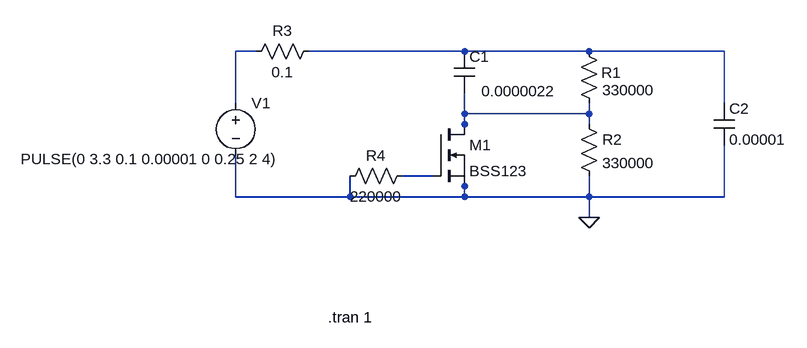
[diagram p0: schematic power-autostart.asc]
power-autostart.asc, the LTspice schematic file:
Version 4
SHEET 1 880 680
WIRE -176 96 -208 96
WIRE 144 96 -96 96
WIRE 336 96 144 96
WIRE 544 96 336 96
WIRE -208 176 -208 96
WIRE 544 176 544 96
WIRE 144 192 144 160
WIRE 336 192 336 176
WIRE 336 192 144 192
WIRE 144 208 144 192
WIRE 336 208 336 192
WIRE 144 224 144 208
WIRE 96 288 48 288
WIRE 144 304 144 288
WIRE -208 320 -208 256
WIRE -32 320 -32 288
WIRE -32 320 -208 320
WIRE 144 320 144 304
WIRE 144 320 -32 320
WIRE 336 320 336 288
WIRE 336 320 144 320
WIRE 544 320 544 240
WIRE 544 320 336 320
WIRE 336 352 336 320
FLAG 336 352 0
SYMBOL res 320 80 R0
WINDOW 0 35 49 Left 0
SYMATTR InstName R1
SYMATTR Value 330000
SYMBOL res 320 192 R0
SYMATTR InstName R2
SYMATTR Value 330000
SYMBOL cap 128 96 R0
WINDOW 3 42 61 Left 0
SYMATTR InstName C1
SYMATTR Value 0.0000022
SYMBOL voltage -208 160 R0
WINDOW 3 -331 102 Left 0
WINDOW 123 0 0 Left 0
WINDOW 39 0 0 Left 0
SYMATTR InstName V1
SYMATTR Value PULSE(0 3.3 0.1 0.00001 0 0.25 2 4)
SYMBOL cap 528 176 R0
SYMATTR InstName C2
SYMATTR Value 0.00001
SYMBOL res -80 80 R90
WINDOW 0 0 56 VBottom 0
WINDOW 3 32 56 VTop 0
SYMATTR InstName R3
SYMATTR Value 0.1
SYMBOL nmos 96 208 R0
SYMATTR InstName M1
SYMATTR Value BSS123
SYMBOL res 64 272 R90
WINDOW 0 0 56 VBottom 0
WINDOW 3 32 56 VTop 0
SYMATTR InstName R4
SYMATTR Value 220000
TEXT -66 506 Left 0 !.tran 1

The netlist it stands for:
* power-autostart.asc
R1 N002 N003 330000
R2 N003 0 330000
C1 N002 N003 0.0000022
V1 N001 0 PULSE(0 3.3 0.1 0.00001 0 0.25 2 4)
C2 N002 0 0.00001
R3 N002 N001 0.1
M1 N003 N004 0 0 BSS123
R4 N004 0 220000
.model NMOS NMOS
.model PMOS PMOS
.lib standard.mos
.tran 1
.backanno
.end